# Altium schematic sheet COMMUNICATION.SchDoc
size 149 x 299 mm
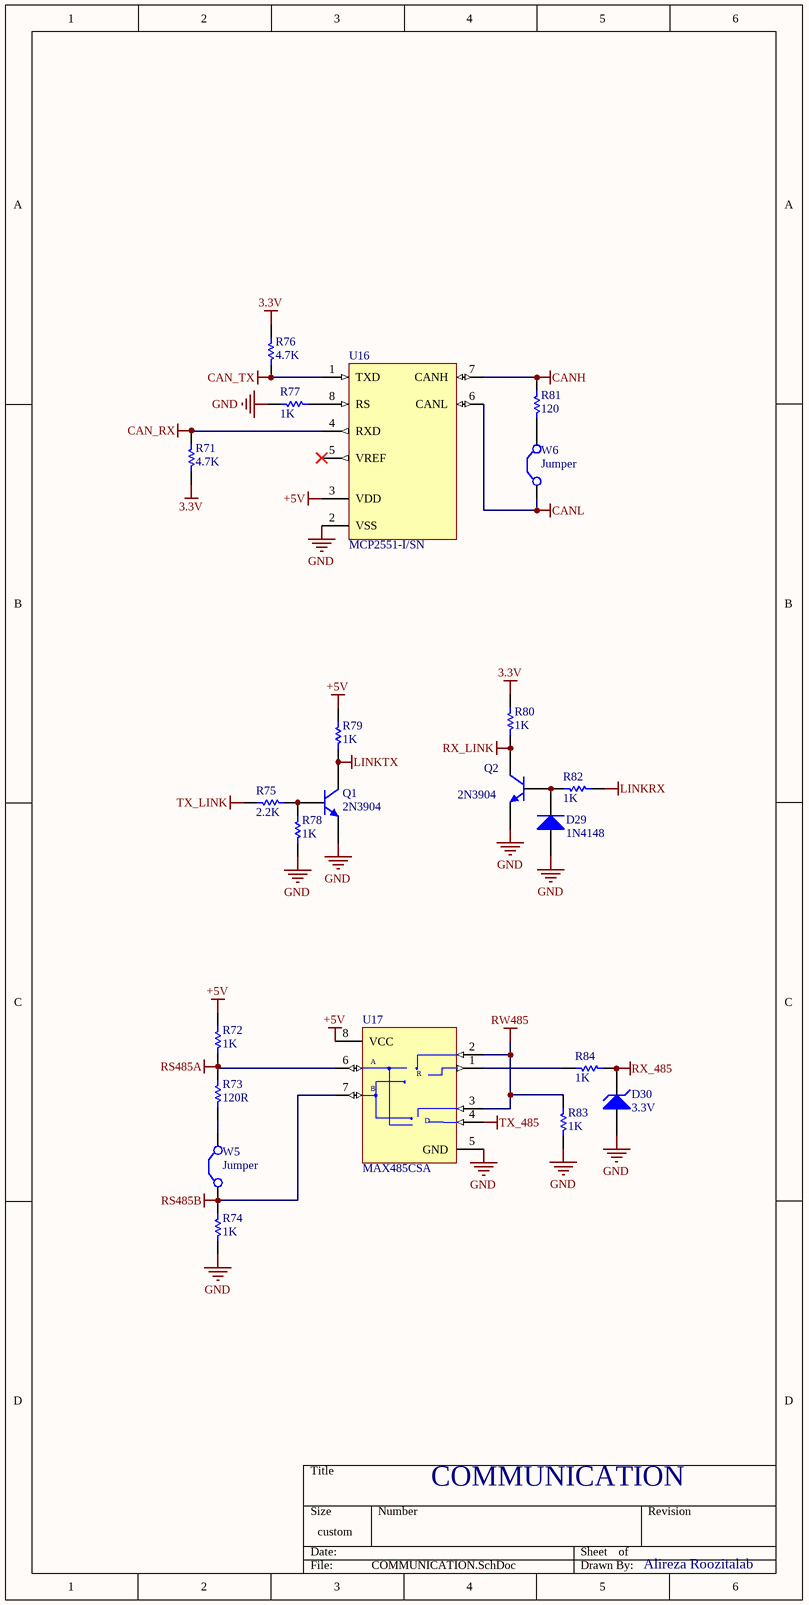
[diagram p0: COMMUNICATION.SchDoc]

## Parts
D29  1N4148  [Diode-1n4148 - SMD PAD]
D30  3.3V  [Diode-1n4148 - SMD PAD]
Q1  2N3904  [2N3906_SMD]
Q2  2N3904  [2N3906_SMD]
R71  value 4.7K  [RES 1206 (3216X08L)]  (hidden comment: Res Semi)
R72  value 1K  [RES 1206 (3216X08L)]  (hidden comment: Res Semi)
R73  value 120R  [RES 1206 (3216X08L)]  (hidden comment: Res Semi)
R74  value 1K  [RES 1206 (3216X08L)]  (hidden comment: Res Semi)
R75  value 2.2K  [RES 1206 (3216X08L)]  (hidden comment: Res Semi)
R76  value 4.7K  [RES 1206 (3216X08L)]  (hidden comment: Res Semi)
R77  value 1K  [RES 1206 (3216X08L)]  (hidden comment: Res Semi)
R78  value 1K  [RES 1206 (3216X08L)]  (hidden comment: Res Semi)
R79  value 1K  [RES 1206 (3216X08L)]  (hidden comment: Res Semi)
R80  value 1K  [RES 1206 (3216X08L)]  (hidden comment: Res Semi)
R81  value 120  [RES 1206 (3216X08L)]  (hidden comment: Res Semi)
R82  value 1K  [RES 1206 (3216X08L)]  (hidden comment: Res Semi)
R83  value 1K  [RES 1206 (3216X08L)]  (hidden comment: Res Semi)
R84  value 1K  [RES 1206 (3216X08L)]  (hidden comment: Res Semi)
U16  MCP2551-I/SN  [SOP8]
U17  MAX485CSA  [SOP8]
W5  Jumper  [RES 0402 (1005X04L)]
W6  Jumper  [RES 0402 (1005X04L)]

## Nets
3.3V: R71.2 R76.1 R80.1
+5V: R72.2 R79.1 U16.3(VDD) U17.8(VCC)
CAN_RX: R71.1 U16.4(RXD)
CAN_TX: R76.2 U16.1(TXD)
CANH: R81.1 U16.7(CANH)
CANL: U16.6(CANL) W6.1(C1)
GND: D29.1(A) D30.1(A) Q1.1(E) Q2.1(E) R74.1 R77.1 R78.2 R83.1 U16.2(VSS) U17.5(GND)
LINKRX: R82.2
LINKTX: Q1.3(C) R79.2
RS485A: R72.1 R73.2 U17.6(A)
RS485B: R74.2 U17.7(B) W5.1(C1)
RW485: R83.2 U17.2(~{RE}) U17.3(DE)
RX_485: D30.2(K) R84.1
RX_LINK: Q2.3(C) R80.2
TX_485: U17.4(DI)
TX_LINK: R75.2
NetD29_2: D29.2(K) Q2.2(B) R82.1
NetQ1_2: Q1.2(B) R75.1 R78.1
NetR73_1: R73.1 W5.2(C2)
NetR77_2: R77.2 U16.8(RS)
NetR81_2: R81.2 W6.2(C2)
NetR84_2: R84.2 U17.1(RO)

Not connected (* = marked no-connect by the designer): U16 5(VREF)*

## Notes on the sheet
- COMMUNICATION
- Alireza Roozitalab
- (in symbol MAX485CSA) R; D

## Library data of the parts
D29 = Diode: Default Diode; Published: 8-Jun-2000; LatestRevisionDate: 17-Jul-2002; LatestRevisionNote: Re-released for DXP Platform.; PackageDocument: Sep-1996; PackageReference: SMC; Publisher: Altium Limited; Code_JEDEC: DO-214-AB
D30 = D Zener: Zener Diode; Published: 8-Jun-2000; LatestRevisionDate: 17-Jul-2002; LatestRevisionNote: Re-released for DXP Platform.; PackageReference: DIODE-0.7; Publisher: Altium Limited
Q1 Q2 = 2N3904: NPN General Purpose Amplifier; pin to pad: 1>2 2>1; Published: 8-Jun-2000; LatestRevisionDate: 15-Jan-2003; LatestRevisionNote: PCB Footprint 'BCY-W3/D4.7' replaced; DatasheetDocument: 1997; PackageDocument: Sep-1998; PackageReference: TO-92A; Publisher: Altium Limited; Code_JEDEC: TO-92A; ComponentLink1Description: Manufacturer Link; ComponentLink1URL: http://www.fairchildsemi.com/; ComponentLink2Description: Datasheet; ComponentLink2URL: http://www.fairchildsemi.com/ds/2N%2F2N3904.pdf
R71-R84 = Res Semi: Semiconductor Resistor; Published: 8-Jun-2000; LatestRevisionDate: 17-Jul-2002; LatestRevisionNote: Re-released for DXP Platform.; PackageReference: AXIAL-0.5; Publisher: Altium Limited
U16 = MCP2551-I/SN: High-Speed CAN Transceiver, 8-Pin SOIC, Industrial Temperature; Manufacturer: Microchip; DatasheetVersion: revF, Jul-2010; PackageVersion: revBB, Aug-2009; PackageReference: SOIC-SN8; PackageDescription: 8-Lead Plastic Small Outline (SN) - Narrow, 3.90mm Body [SOIC]; Supplier 1: Digi-Key; Supplier Part Number 1: MCP2551-I/SN-ND; Supplier 2: Farnell; Supplier Part Number 2: 9758569; Supplier 3: Newark; Supplier Part Number 3: 69K7604; Supplier 4: Mouser; Supplier Part Number 4: 579-MCP2551-I/SN; Mounting Technology: Surface Mount; Code_JEDEC: MS-012; Code_IPC: SOIC127P600-8; PartNumber: MCP2551-I/SN; ComponentLink1Description: Manufacturer URL; ComponentLink1URL: http://www.microchip.com/; ComponentLink2Description: Datasheet; ComponentLink2URL: http://ww1.microchip.com/downloads/en/DeviceDoc/21667F.pdf; ComponentLink3Description: Package Specification; ComponentLink3URL: http://www.microchip.com/stellent/groups/techpub_sg/documents/packagingspec/en012702.pdf
U17 = MAX485CSA: Low-Power, Slew-Rate-Limited RS-485/RS-422 Transceiver; Published: 16-Jan-2001; LatestRevisionDate: 13-Apr-2006; LatestRevisionNote: IPC-7351 Footprint Added.; DatasheetVersion: Feb-1996; PackageReference: NSO8; Publisher: Altium Limited; PackageDescription: 8-Pin Small Outline Integrated Circuit 1.27 mm Pitch; Code_JEDEC: MS-012-AA; Code_IPC: SOIC127P600-8; ComponentLink1Description: Manufacturer Link; ComponentLink1URL: http://www.maxim-ic.com/; ComponentLink2Description: Datasheet; ComponentLink2URL: http://pdfserv.maxim-ic.com/en/ds/MAX1487-MAX491.pdf
W5 W6 = Jumper: Jumper Wire; Published: 24-Mar-1999; LatestRevisionDate: 17-Jul-2002; LatestRevisionNote: Re-released for DXP Platform.; PackageReference: RAD-0.2; Publisher: Altium Limited